# EAGLE design same70_bb (EAGLE 7.3.0)
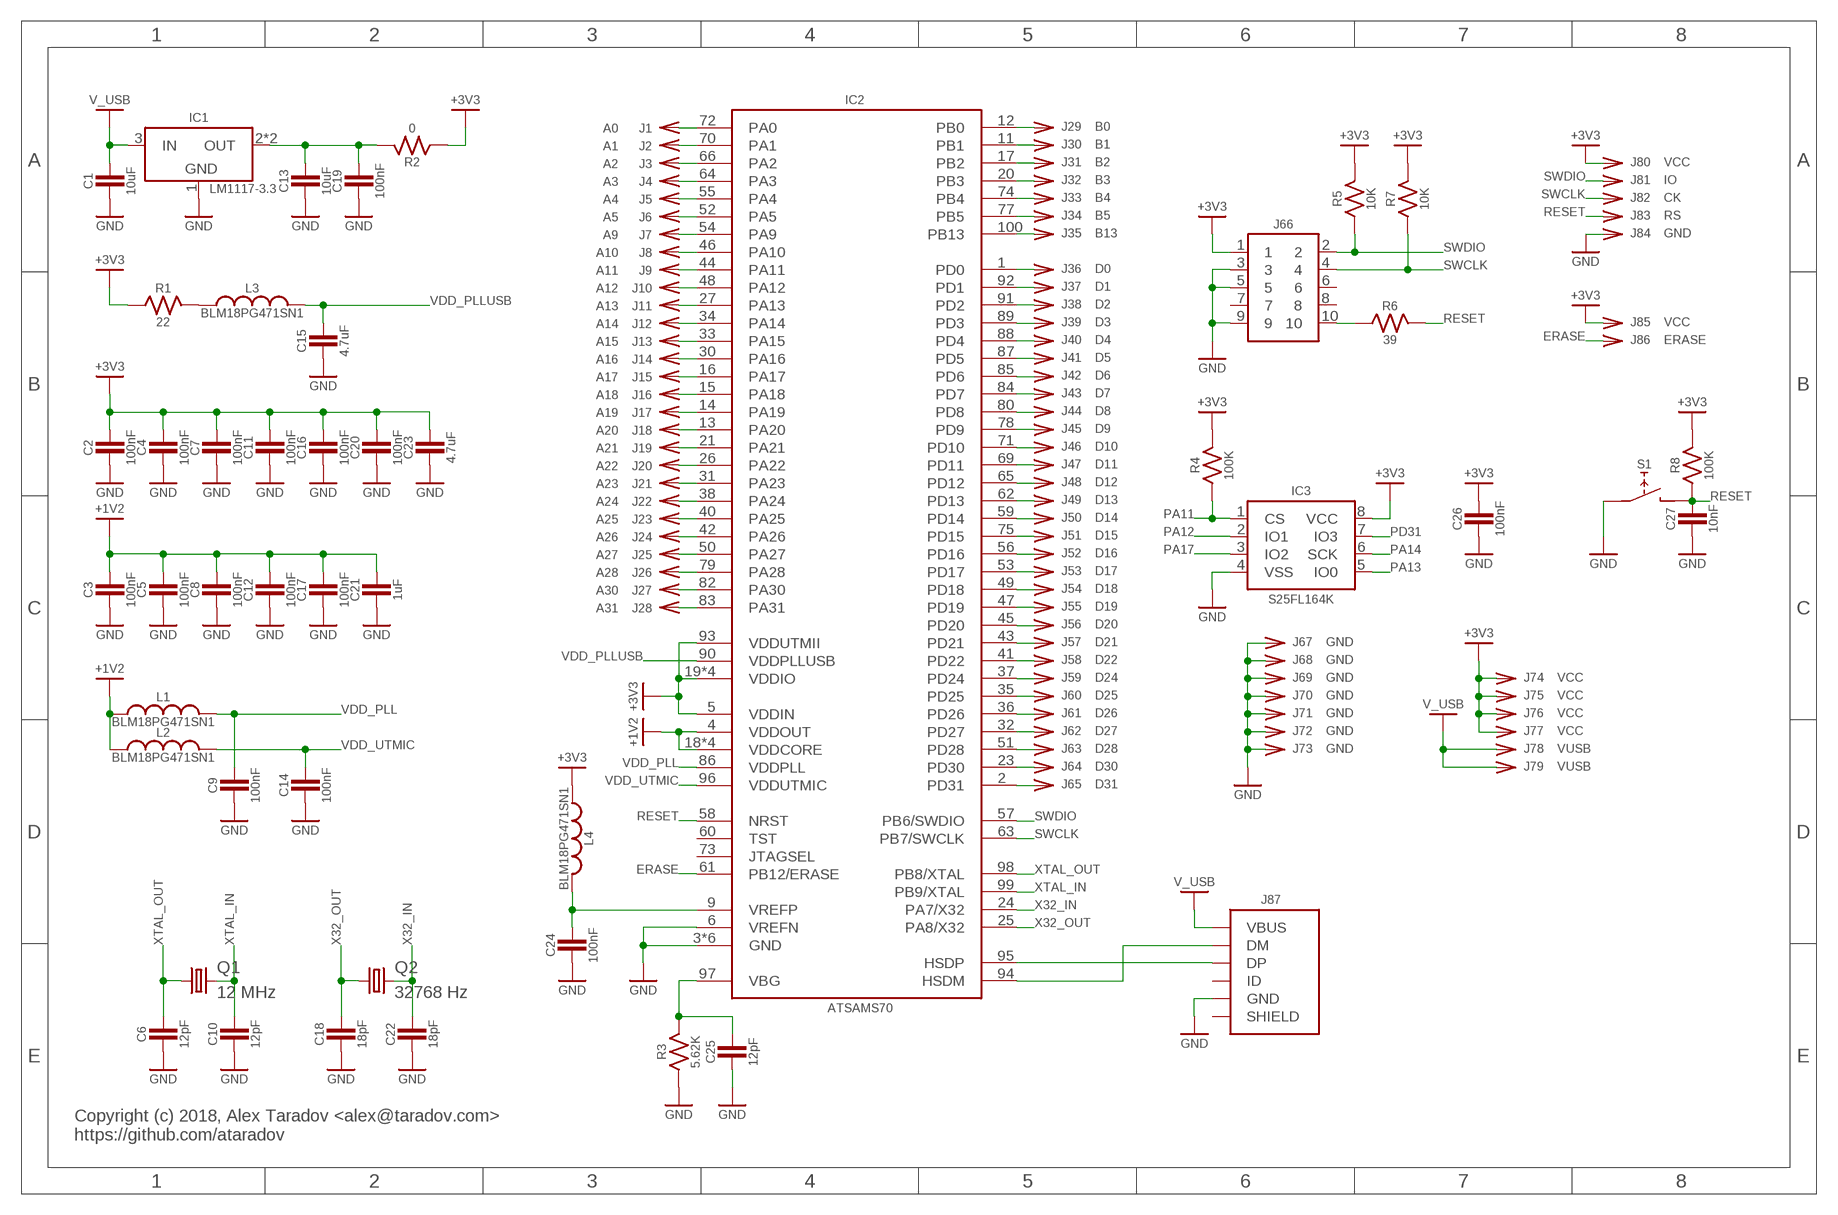
[diagram p0: schematic, sheet 1]

## Parts
C1  10uF  C-0805  [SMD0805]
C2  100nF  C-0603  [SMD0603]
C3  100nF  C-0603  [SMD0603]
C4  100nF  C-0603  [SMD0603]
C5  100nF  C-0603  [SMD0603]
C6  12pF  C-0603  [SMD0603]
C7  100nF  C-0603  [SMD0603]
C8  100nF  C-0603  [SMD0603]
C9  100nF  C-0603  [SMD0603]
C10  12pF  C-0603  [SMD0603]
C11  100nF  C-0603  [SMD0603]
C12  100nF  C-0603  [SMD0603]
C13  10uF  C-0805  [SMD0805]
C14  100nF  C-0603  [SMD0603]
C15  4.7uF  C-0603  [SMD0603]
C16  100nF  C-0603  [SMD0603]
C17  100nF  C-0603  [SMD0603]
C18  18pF  C-0603  [SMD0603]
C19  100nF  C-0603  [SMD0603]
C20  100nF  C-0603  [SMD0603]
C21  1uF  C-0603  [SMD0603]
C22  18pF  C-0603  [SMD0603]
C23  4.7uF  C-0603  [SMD0603]
C24  100nF  C-0603  [SMD0603]
C25  12pF  C-0603  [SMD0603]
C26  100nF  C-0603  [SMD0603]
C27  10nF  C-0603  [SMD0603]
IC1  LM1117-3.3  LM1117-SOT223  [SOT223]
IC2  ATSAMS70  [TQFP-100-0.5MM]
IC3  S25FL164K  S25FL1-K  [SO8]
J1  A0  CONN-SINGLE-TH  [PIN-TH]
J2  A1  CONN-SINGLE-TH  [PIN-TH]
J3  A2  CONN-SINGLE-TH  [PIN-TH]
J4  A3  CONN-SINGLE-TH  [PIN-TH]
J5  A4  CONN-SINGLE-TH  [PIN-TH]
J6  A5  CONN-SINGLE-TH  [PIN-TH]
J7  A9  CONN-SINGLE-TH  [PIN-TH]
J8  A10  CONN-SINGLE-TH  [PIN-TH]
J9  A11  CONN-SINGLE-TH  [PIN-TH]
J10  A12  CONN-SINGLE-TH  [PIN-TH]
J11  A13  CONN-SINGLE-TH  [PIN-TH]
J12  A14  CONN-SINGLE-TH  [PIN-TH]
J13  A15  CONN-SINGLE-TH  [PIN-TH]
J14  A16  CONN-SINGLE-TH  [PIN-TH]
J15  A17  CONN-SINGLE-TH  [PIN-TH]
J16  A18  CONN-SINGLE-TH  [PIN-TH]
J17  A19  CONN-SINGLE-TH  [PIN-TH]
J18  A20  CONN-SINGLE-TH  [PIN-TH]
J19  A21  CONN-SINGLE-TH  [PIN-TH]
J20  A22  CONN-SINGLE-TH  [PIN-TH]
J21  A23  CONN-SINGLE-TH  [PIN-TH]
J22  A24  CONN-SINGLE-TH  [PIN-TH]
J23  A25  CONN-SINGLE-TH  [PIN-TH]
J24  A26  CONN-SINGLE-TH  [PIN-TH]
J25  A27  CONN-SINGLE-TH  [PIN-TH]
J26  A28  CONN-SINGLE-TH  [PIN-TH]
J27  A30  CONN-SINGLE-TH  [PIN-TH]
J28  A31  CONN-SINGLE-TH  [PIN-TH]
J29  B0  CONN-SINGLE-TH  [PIN-TH]
J30  B1  CONN-SINGLE-TH  [PIN-TH]
J31  B2  CONN-SINGLE-TH  [PIN-TH]
J32  B3  CONN-SINGLE-TH  [PIN-TH]
J33  B4  CONN-SINGLE-TH  [PIN-TH]
J34  B5  CONN-SINGLE-TH  [PIN-TH]
J35  B13  CONN-SINGLE-TH  [PIN-TH]
J36  D0  CONN-SINGLE-TH  [PIN-TH]
J37  D1  CONN-SINGLE-TH  [PIN-TH]
J38  D2  CONN-SINGLE-TH  [PIN-TH]
J39  D3  CONN-SINGLE-TH  [PIN-TH]
J40  D4  CONN-SINGLE-TH  [PIN-TH]
J41  D5  CONN-SINGLE-TH  [PIN-TH]
J42  D6  CONN-SINGLE-TH  [PIN-TH]
J43  D7  CONN-SINGLE-TH  [PIN-TH]
J44  D8  CONN-SINGLE-TH  [PIN-TH]
J45  D9  CONN-SINGLE-TH  [PIN-TH]
J46  D10  CONN-SINGLE-TH  [PIN-TH]
J47  D11  CONN-SINGLE-TH  [PIN-TH]
J48  D12  CONN-SINGLE-TH  [PIN-TH]
J49  D13  CONN-SINGLE-TH  [PIN-TH]
J50  D14  CONN-SINGLE-TH  [PIN-TH]
J51  D15  CONN-SINGLE-TH  [PIN-TH]
J52  D16  CONN-SINGLE-TH  [PIN-TH]
J53  D17  CONN-SINGLE-TH  [PIN-TH]
J54  D18  CONN-SINGLE-TH  [PIN-TH]
J55  D19  CONN-SINGLE-TH  [PIN-TH]
J56  D20  CONN-SINGLE-TH  [PIN-TH]
J57  D21  CONN-SINGLE-TH  [PIN-TH]
J58  D22  CONN-SINGLE-TH  [PIN-TH]
J59  D24  CONN-SINGLE-TH  [PIN-TH]
J60  D25  CONN-SINGLE-TH  [PIN-TH]
J61  D26  CONN-SINGLE-TH  [PIN-TH]
J62  D27  CONN-SINGLE-TH  [PIN-TH]
J63  D28  CONN-SINGLE-TH  [PIN-TH]
J64  D30  CONN-SINGLE-TH  [PIN-TH]
J65  D31  CONN-SINGLE-TH  [PIN-TH]
J66  HEADER-5X2-TH-1.27  [HEADER-5X2-1.27MM]
J67  GND  CONN-SINGLE-TH  [PIN-TH]
J68  GND  CONN-SINGLE-TH  [PIN-TH]
J69  GND  CONN-SINGLE-TH  [PIN-TH]
J70  GND  CONN-SINGLE-TH  [PIN-TH]
J71  GND  CONN-SINGLE-TH  [PIN-TH]
J72  GND  CONN-SINGLE-TH  [PIN-TH]
J73  GND  CONN-SINGLE-TH  [PIN-TH]
J74  VCC  CONN-SINGLE-TH  [PIN-TH]
J75  VCC  CONN-SINGLE-TH  [PIN-TH]
J76  VCC  CONN-SINGLE-TH  [PIN-TH]
J77  VCC  CONN-SINGLE-TH  [PIN-TH]
J78  VUSB  CONN-SINGLE-TH  [PIN-TH]
J79  VUSB  CONN-SINGLE-TH  [PIN-TH]
J80  VCC  CONN-SINGLE-TH  [PIN-TH]
J81  IO  CONN-SINGLE-TH  [PIN-TH]
J82  CK  CONN-SINGLE-TH  [PIN-TH]
J83  RS  CONN-SINGLE-TH  [PIN-TH]
J84  GND  CONN-SINGLE-TH  [PIN-TH]
J85  VCC  CONN-SINGLE-TH  [PIN-TH]
J86  ERASE  CONN-SINGLE-TH  [PIN-TH]
J87  USB-B-MICRO-SMT  [USB-B-MICRO-SMT-SHELL-TH]
L1  BLM18PG471SN1  L-0603  [SMD0603]
L2  BLM18PG471SN1  L-0603  [SMD0603]
L3  BLM18PG471SN1  L-0603  [SMD0603]
L4  BLM18PG471SN1  L-0603  [SMD0603]
Q1  12 MHz  CRYSTALCTS406  [CTS406]
Q2  32768 Hz  CRYSTALTC38H  [TC38H]
R1  22  R-0603  [SMD0603]
R2  0  R-0603  [SMD0603]
R3  5.62K  R-0603  [SMD0603]
R4  100K  R-0603  [SMD0603]
R5  10K  R-0603  [SMD0603]
R6  39  R-0603  [SMD0603]
R7  10K  R-0603  [SMD0603]
R8  100K  R-0603  [SMD0603]
S1  TACT_SWITCH_6MM-SMD  [TACT-SMD-6MM]

## Nets
+1V2: C3.2 C5.2 C8.2 C12.2 C17.2 C21.2 IC2.4(VDDOUT) IC2.18(VDDCORE) IC2.22(VDDCORE) IC2.39(VDDCORE) IC2.76(VDDCORE) L1.1 L2.1
+3V3: C2.2 C4.2 C7.2 C11.2 C16.2 C20.2 C23.2 C26.2 IC2.5(VDDIN) IC2.19(VDDIO) IC2.28(VDDIO) IC2.68(VDDIO) IC2.81(VDDIO) IC2.93(VDDUTMII) IC3.8(VCC) J66.1 J74.1 J75.1 J76.1 J77.1 J80.1 J85.1 L4.1 R1.1 R2.1 R4.2 R5.2 R7.2 R8.2
ERASE: IC2.61(PB12/ERASE) J86.1
GND: C1.1 C2.1 C3.1 C4.1 C5.1 C6.1 C7.1 C8.1 C9.1 C10.1 C11.1 C12.1 C13.1 C14.1 C15.1 C16.1 C17.1 C18.1 C19.1 C20.1 C21.1 C22.1 C23.1 C24.1 C25.1 C26.1 C27.1 IC1.1(GND) IC2.3(GND) IC2.6(VREFN) IC2.7(GND) IC2.8(GND) IC2.10(GND) IC2.29(GND) IC2.67(GND) IC3.4(VSS) J66.3 J66.5 J66.9 J67.1 J68.1 J69.1 J70.1 J71.1 J72.1 J73.1 J84.1 J87.5(GND) R3.1 S1.1 S1.2
N$1: IC2.45(PD20) J56.1
N$2: J66.10 R6.1
N$3: IC2.12(PB0) J29.1
N$4: IC2.11(PB1) J30.1
N$5: IC2.17(PB2) J31.1
N$6: IC2.20(PB3) J32.1
N$7: IC2.74(PB4) J33.1
N$8: IC2.77(PB5) J34.1
N$9: IC2.89(PD3) J39.1
N$12: IC2.47(PD19) J55.1
N$13: IC2.49(PD18) J54.1
N$14: IC2.53(PD17) J53.1
N$15: IC2.100(PB13) J35.1
N$16: IC2.1(PD0) J36.1
N$17: IC2.92(PD1) J37.1
N$18: IC2.91(PD2) J38.1
N$19: IC2.56(PD16) J52.1
N$20: IC2.75(PD15) J51.1
N$21: IC2.59(PD14) J50.1
N$22: IC2.62(PD13) J49.1
N$23: IC2.65(PD12) J48.1
N$24: IC2.69(PD11) J47.1
N$25: IC2.71(PD10) J46.1
N$26: IC2.78(PD9) J45.1
N$27: IC2.80(PD8) J44.1
N$28: IC2.84(PD7) J43.1
N$30: IC2.23(PD30) J64.1
N$31: IC2.51(PD28) J63.1
N$32: IC2.32(PD27) J62.1
N$33: IC2.36(PD26) J61.1
N$34: IC2.35(PD25) J60.1
N$35: IC2.37(PD24) J59.1
N$36: IC2.41(PD22) J58.1
N$37: IC2.43(PD21) J57.1
N$38: IC2.85(PD6) J42.1
N$39: IC2.72(PA0) J1.1
N$40: IC2.70(PA1) J2.1
N$41: IC2.66(PA2) J3.1
N$42: IC2.64(PA3) J4.1
N$43: IC2.55(PA4) J5.1
N$44: IC2.52(PA5) J6.1
N$45: IC2.54(PA9) J7.1
N$46: IC2.46(PA10) J8.1
N$48: IC2.88(PD4) J40.1
N$49: IC2.87(PD5) J41.1
N$51: IC2.33(PA15) J13.1
N$52: IC2.30(PA16) J14.1
N$54: IC2.15(PA18) J16.1
N$55: IC2.14(PA19) J17.1
N$56: IC2.13(PA20) J18.1
N$57: IC2.21(PA21) J19.1
N$58: IC2.26(PA22) J20.1
N$59: IC2.31(PA23) J21.1
N$60: IC2.38(PA24) J22.1
N$61: IC2.42(PA26) J24.1
N$62: IC2.50(PA27) J25.1
N$63: IC2.79(PA28) J26.1
N$64: IC2.82(PA30) J27.1
N$65: IC2.83(PA31) J28.1
N$66: IC2.40(PA25) J23.1
N$68: C25.2 IC2.97(VBG) R3.2
N$70: IC2.94(HSDM) J87.2(DM)
N$71: C24.2 IC2.9(VREFP) L4.2
N$72: C13.2 C19.2 IC1.2(OUT) IC1.4(OUT) R2.2
N$73: IC2.95(HSDP) J87.3(DP)
N$74: L3.1 R1.2
PA11: IC2.44(PA11) IC3.1(CS) J9.1 R4.1
PA12: IC2.48(PA12) IC3.2(IO1) J10.1
PA13: IC2.27(PA13) IC3.5(IO0) J11.1
PA14: IC2.34(PA14) IC3.6(SCK) J12.1
PA17: IC2.16(PA17) IC3.3(IO2) J15.1
PD31: IC2.2(PD31) IC3.7(IO3) J65.1
RESET: C27.2 IC2.58(NRST) J83.1 R6.2 R8.1 S1.3 S1.4
SWCLK: IC2.63(PB7/SWCLK) J66.4 J82.1 R7.1
SWDIO: IC2.57(PB6/SWDIO) J66.2 J81.1 R5.1
V_USB: C1.2 IC1.3(IN) J78.1 J79.1 J87.1(VBUS)
VDD_PLL: C9.2 IC2.86(VDDPLL) L1.2
VDD_PLLUSB: C15.2 IC2.90(VDDPLLUSB) L3.2
VDD_UTMIC: C14.2 IC2.96(VDDUTMIC) L2.2
X32_IN: C22.2 IC2.24(PA7/X32) Q2.2
X32_OUT: C18.2 IC2.25(PA8/X32) Q2.1
XTAL_IN: C10.2 IC2.99(PB9/XTAL) Q1.3
XTAL_OUT: C6.2 IC2.98(PB8/XTAL) Q1.1
Unconnected: IC2.60(TST) IC2.73(JTAGSEL) J66.6 J66.7 J66.8 J87.4(ID) J87.M1(SHIELD) J87.M2(SHIELD) J87.M3(SHIELD) J87.M4(SHIELD)

## Notes on the sheet
- Copyright (c) 2018, Alex Taradov <alex@taradov.com>
  https://github.com/ataradov

## Library data of the parts
C1-C27 = ataradov:C
IC1 = ataradov:LM1117: LM1117 voltage regulator
IC2 = ataradov:ATSAMS70
IC3 = ataradov:S25FL1-K
J1-J65 J67-J86 = ataradov:CONN-SINGLE
J66 = ataradov:HEADER-5X2
J87 = ataradov_conn:USB-B-MICRO
L1-L4 = ataradov:L
Q1 Q2 = crystal:CRYSTAL: CRYSTAL; OC_FARNELL: unknown; OC_NEWARK: unknown
R1-R8 = ataradov:R
S1 = ataradov:TACT_SWITCH_6MM

## Board
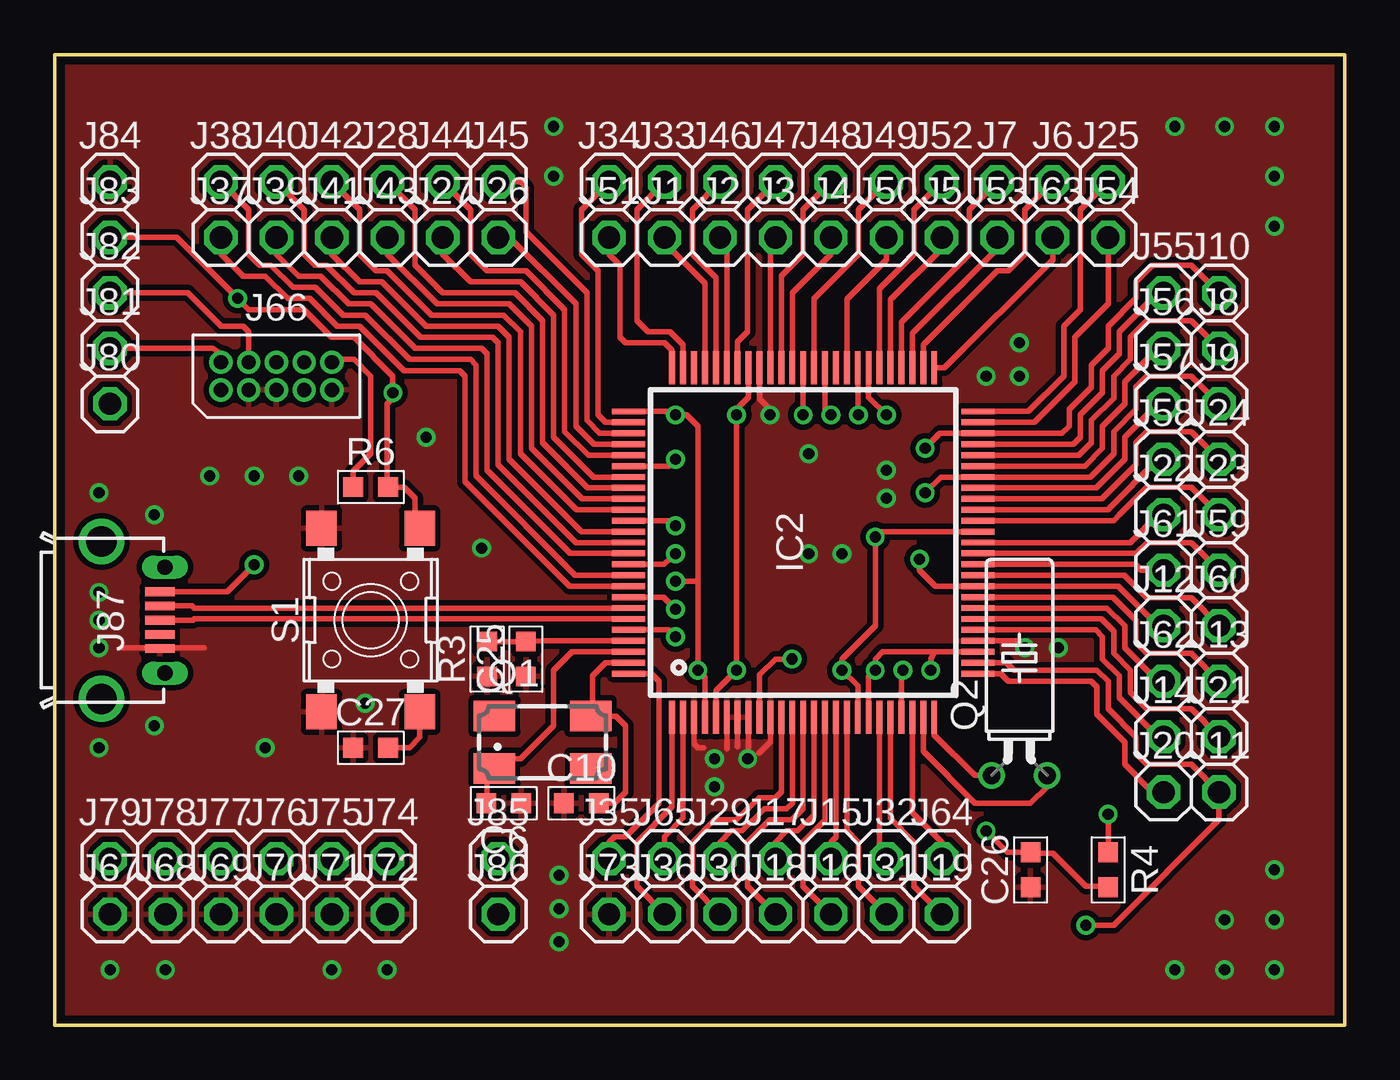
[diagram p1: board, top side]
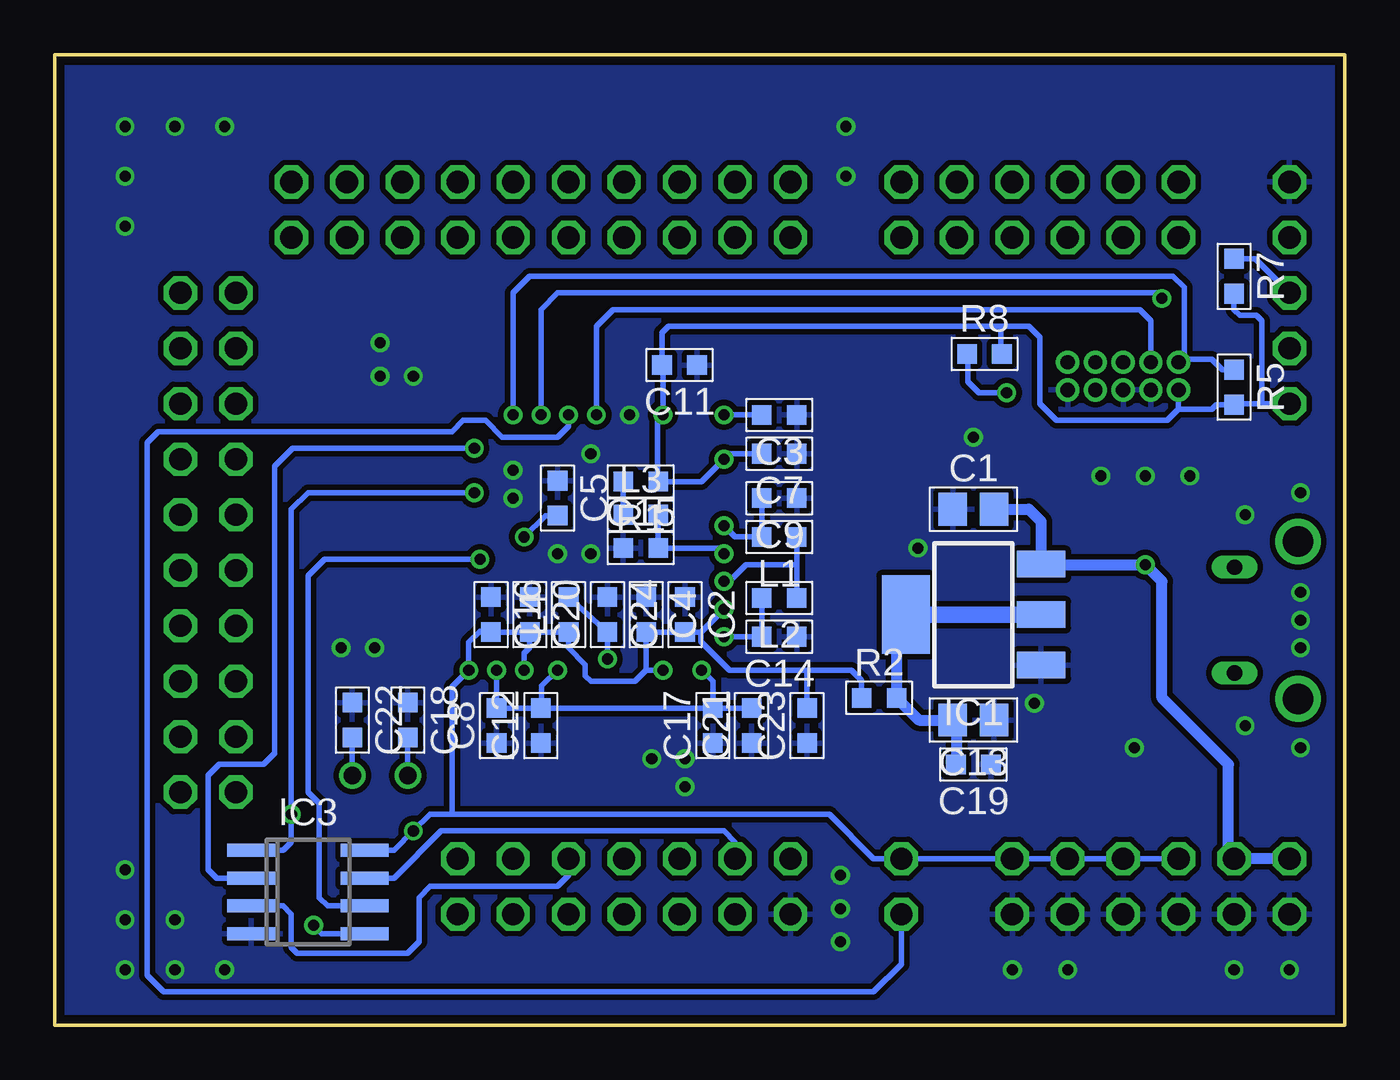
[diagram p2: board, bottom side, seen from below]

Size 59.11 x 44.44 mm. Coordinates in mm from the lower left corner, seen from the top.
Outline: 0,0 59.11,0 59.11,44.44 0,44.44 0,0
Copper layers (1*16): Top 0.0356mm / dielectric 1.5011mm / Bottom 0.0356mm
Design rules "std-tented": minimum track width 6mil, minimum drill 13mil, track to track 6mil, track to pad 6mil, pad to pad 6mil, via to via 6mil, smd to smd 6mil, copper to edge 15mil, drill to drill 6mil, minimum pad ring 7mil, minimum via ring 7mil, stop-mask expansion 3mil, vias tented up to drill 25mil, thermal gap 10mil

### Footprints (pad centres in the part's own frame; a part is rotated, then mirrored left to right if it is on the bottom)
SMD0805 = smd 1.3 x 1.5: 1 -0.95,0; 2 0.95,0
SMD0603 = smd 0.9 x 0.9: 1 -0.8,0; 2 0.8,0
SOT223 = smd 1.219 x 2.235: 1 -2.311,-3.099; 2 0,-3.099; 3 2.311,-3.099 | smd 3.6 x 2.2: 4 0,3.099
TQFP-100-0.5MM = smd 1.5 x 0.27: 1 -8,6; 2 -8,5.5; 3 -8,5; 4 -8,4.5; 5 -8,4; 6 -8,3.5; 7 -8,3; 8 -8,2.5; 9 -8,2; 10 -8,1.5; 11 -8,1; 12 -8,0.5; 13 -8,0; 14 -8,-0.5; 15 -8,-1; 16 -8,-1.5; 17 -8,-2; 18 -8,-2.5; 19 -8,-3; 20 -8,-3.5; 21 -8,-4; 22 -8,-4.5; 23 -8,-5; 24 -8,-5.5; 25 -8,-6; 51 8,-6; 52 8,-5.5; 53 8,-5; 54 8,-4.5; 55 8,-4; 56 8,-3.5; 57 8,-3; 58 8,-2.5; 59 8,-2; 60 8,-1.5; 61 8,-1; 62 8,-0.5; 63 8,0; 64 8,0.5; 65 8,1; 66 8,1.5; 67 8,2; 68 8,2.5; 69 8,3; 70 8,3.5; 71 8,4; 72 8,4.5; 73 8,5; 74 8,5.5; 75 8,6 | smd 0.27 x 1.5: 26 -6,-8; 27 -5.5,-8; 28 -5,-8; 29 -4.5,-8; 30 -4,-8; 31 -3.5,-8; 32 -3,-8; 33 -2.5,-8; 34 -2,-8; 35 -1.5,-8; 36 -1,-8; 37 -0.5,-8; 38 0,-8; 39 0.5,-8; 40 1,-8; 41 1.5,-8; 42 2,-8; 43 2.5,-8; 44 3,-8; 45 3.5,-8; 46 4,-8; 47 4.5,-8; 48 5,-8; 49 5.5,-8; 50 6,-8; 76 6,8; 77 5.5,8; 78 5,8; 79 4.5,8; 80 4,8; 81 3.5,8; 82 3,8; 83 2.5,8; 84 2,8; 85 1.5,8; 86 1,8; 87 0.5,8; 88 0,8; 89 -0.5,8; 90 -1,8; 91 -1.5,8; 92 -2,8; 93 -2.5,8; 94 -3,8; 95 -3.5,8; 96 -4,8; 97 -4.5,8; 98 -5,8; 99 -5.5,8; 100 -6,8
SO8 = smd 0.6 x 2.2: 1 -1.905,-2.6; 2 -0.635,-2.6; 3 0.635,-2.6; 4 1.905,-2.6; 5 1.905,2.6; 6 0.635,2.6; 7 -0.635,2.6; 8 -1.905,2.6
PIN-TH = drill 1.016 octagon: 1 0,0
HEADER-5X2-1.27MM = drill 0.66 pad 1.067: 1 -2.54,-0.635; 2 -2.54,0.635; 3 -1.27,-0.635; 4 -1.27,0.635; 5 0,-0.635; 6 0,0.635; 7 1.27,-0.635; 8 1.27,0.635; 9 2.54,-0.635; 10 2.54,0.635
USB-B-MICRO-SMT-SHELL-TH = smd 1.35 x 0.4: 1 4.825,1.3; 2 4.825,0.65; 3 4.825,0; 4 4.825,-0.65; 5 4.825,-1.3 | drill 1.397: M1 2.15,-3.6; M2 2.15,3.6 | drill 0.7 long: M3 5.05,2.425; M4 5.05,-2.425
CTS406 = smd 1.9 x 1.4: 1 -2.2,-1.2; 2 2.2,-1.2; 3 2.2,1.2; 4 -2.2,1.2
TC38H = drill 0.813: 1 -1.27,0; 2 1.27,0
TACT-SMD-6MM = smd 1.6 x 1.4: 1 -4.2,2.25; 2 4.2,2.25; 3 -4.2,-2.25; 4 4.2,-2.25

### Placement (x,y rotation side)
C1  17.02,23.62 0 bottom
C2  30.23,18.8 270 bottom
C3  25.91,27.94 180 bottom
C4  32,18.8 270 bottom
C5  36.07,24.13 270 bottom
C6  20.57,10.16 180 top
C7  25.91,26.16 180 bottom
C8  38.86,13.72 90 bottom
C9  25.91,24.13 180 bottom
C10  24.13,10.16 0 top
C11  30.48,30.23 180 bottom
C12  36.83,13.72 90 bottom
C13  17.02,13.97 180 bottom
C14  25.91,17.78 180 bottom
C15  32.26,21.84 0 bottom
C16  39.12,18.8 270 bottom
C17  28.96,13.72 90 bottom
C18  42.93,13.97 270 bottom
C19  17.02,11.94 180 bottom
C20  37.34,18.8 270 bottom
C21  27.18,13.72 90 bottom
C22  45.47,13.97 270 bottom
C23  24.64,13.72 90 bottom
C24  33.78,18.8 270 bottom
C25  21.59,16.76 90 top
C26  44.7,7.11 90 top
C27  14.48,12.7 0 top
IC1  17.02,18.8 90 bottom
IC2  34.29,22.1 90 top
IC3  47.5,6.1 270 bottom
J1  27.94,36.07 0 top
J2  30.48,36.07 0 top
J3  33.02,36.07 0 top
J4  35.56,36.07 0 top
J5  40.64,36.07 0 top
J6  45.72,38.61 0 top
J7  43.18,38.61 0 top
J8  53.34,30.99 0 top
J9  53.34,28.45 0 top
J10  53.34,33.53 0 top
J11  53.34,10.67 0 top
J12  50.8,18.29 0 top
J13  53.34,15.75 0 top
J14  50.8,13.21 0 top
J15  35.56,7.62 0 top
J16  35.56,5.08 0 top
J17  33.02,7.62 0 top
J18  33.02,5.08 0 top
J19  40.64,5.08 0 top
J20  50.8,10.67 0 top
J21  53.34,13.21 0 top
J22  50.8,23.37 0 top
J23  53.34,23.37 0 top
J24  53.34,25.91 0 top
J25  48.26,38.61 0 top
J26  20.32,36.07 0 top
J27  17.78,36.07 0 top
J28  15.24,38.61 0 top
J29  30.48,7.62 0 top
J30  30.48,5.08 0 top
J31  38.1,5.08 0 top
J32  38.1,7.62 0 top
J33  27.94,38.61 0 top
J34  25.4,38.61 0 top
J35  25.4,7.62 0 top
J36  27.94,5.08 0 top
J37  7.62,36.07 0 top
J38  7.62,38.61 0 top
J39  10.16,36.07 0 top
J40  10.16,38.61 0 top
J41  12.7,36.07 0 top
J42  12.7,38.61 0 top
J43  15.24,36.07 0 top
J44  17.78,38.61 0 top
J45  20.32,38.61 0 top
J46  30.48,38.61 0 top
J47  33.02,38.61 0 top
J48  35.56,38.61 0 top
J49  38.1,38.61 0 top
J50  38.1,36.07 0 top
J51  25.4,36.07 0 top
J52  40.64,38.61 0 top
J53  43.18,36.07 0 top
J54  48.26,36.07 0 top
J55  50.8,33.53 0 top
J56  50.8,30.99 0 top
J57  50.8,28.45 0 top
J58  50.8,25.91 0 top
J59  53.34,20.83 0 top
J60  53.34,18.29 0 top
J61  50.8,20.83 0 top
J62  50.8,15.75 0 top
J63  45.72,36.07 0 top
J64  40.64,7.62 0 top
J65  27.94,7.62 0 top
J66  10.16,29.72 0 top
J67  2.54,5.08 0 top
J68  5.08,5.08 0 top
J69  7.62,5.08 0 top
J70  10.16,5.08 0 top
J71  12.7,5.08 0 top
J72  15.24,5.08 0 top
J73  25.4,5.08 0 top
J74  15.24,7.62 0 top
J75  12.7,7.62 0 top
J76  10.16,7.62 0 top
J77  7.62,7.62 0 top
J78  5.08,7.62 0 top
J79  2.54,7.62 0 top
J80  2.54,28.45 0 top
J81  2.54,30.99 0 top
J82  2.54,33.53 0 top
J83  2.54,36.07 0 top
J84  2.54,38.61 0 top
J85  20.32,7.62 0 top
J86  20.32,5.08 0 top
J87  0,18.54 0 top
L1  25.91,22.35 180 bottom
L2  25.91,19.56 180 bottom
L3  32.26,23.37 0 bottom
L4  35.56,18.8 90 bottom
Q1  22.35,12.95 0 top
Q2  44.2,11.43 0 top
R1  32.26,24.89 180 bottom
R2  21.34,14.99 0 bottom
R3  19.81,16.76 90 top
R4  48.26,7.11 270 top
R5  5.08,29.21 270 bottom
R6  14.48,24.64 0 top
R7  5.08,34.29 270 bottom
R8  16.51,30.73 0 bottom
S1  14.48,18.54 90 top

### Tracks (layer width: path | path; a pad name or v marks a point on that pad's centre or on a via)
+1V2  (via drill 0.51)
  Top 0.254: v38.86,16.26 38.79,16.18 IC2.22 | IC2.18 36.79,15.53 v36.07,16.26 36.07,16.76 37.59,18.29 v37.59,22.35 37.84,22.6 IC2.39 | IC2.4 29.79,15.93 v29.46,16.26 29.46,20.32 | IC2.76 28.04,28.1 28.19,27.94 v28.45,27.94 28.96,27.94 29.46,27.43 29.46,20.32 | v28.45,20.32 29.46,20.32
  Bottom 0.254: v38.86,16.26 C8.2 C12.2 | C21.2 C17.2 | C17.2 28.96,15.75 v29.46,16.26 | C12.2 36.79,14.56 36.79,15.53 v36.07,16.26 | C3.2 v28.45,27.94 | L1.1 25.11,21.08 | 25.11,21.08 L2.1 | v28.45,20.32 28.19,20.32 27.43,21.08 25.11,21.08 | C12.2 C17.2 | v37.59,22.35 36.61,23.33 C5.2
+3V3  (via drill 0.51)
  Top 0.254: IC2.19 37.29,15.95 v37.59,16.26 37.59,16.76 37.93,17.1 40.31,17.1 | IC2.5 30.29,15.3 v31.24,16.26 v31.24,27.94 31.24,28.19 31.79,28.74 IC2.68 | IC2.93 27.9,19.6 v28.45,19.05 | v28.45,25.91 28.14,25.6 IC2.81 | v40.13,16.26 40.13,16.76 40.31,17.1 | 40.31,17.1 IC2.28 | R4.2 48.22,6.35 47.24,6.35 45.72,7.87 44.74,7.87 C26.2 43.65,7.91 v42.67,8.89
  Bottom 0.254: C16.2 C20.2 | C7.2 28.19,26.16 v28.45,25.91 29.46,24.89 R1.1 31.5,24.89 31.5,27.69 v31.24,27.94 31.24,29.72 C11.2 31.28,31.71 30.99,32 15.75,32 | v28.45,19.05 29.5,18 | 29.5,18 C2.2 C4.2 32,16.26 | C20.2 L4.1 35.56,17.27 34.8,16.51 34.8,16 34.54,15.75 32.51,15.75 32,16.26 | 32,16.26 v31.24,16.26 | C20.2 37.34,17.27 37.59,17.02 v37.59,16.26 | 24.64,16.26 28.19,16.26 29.5,17.56 29.5,18 | C23.2 24.64,16.26 | 24.64,16.26 22.61,16.26 22.14,15.79 R2.1 | 39.12,18.03 39.62,18.03 40.13,17.53 v40.13,16.26 40.89,15.49 40.89,9.65 | IC3.8 43.56,8 v42.67,8.89 41.91,9.65 40.89,9.65 | 40.89,9.65 23.62,9.65 21.59,7.62 J85.1 J74.1 J75.1 J76.1 J77.1 | R7.2 5.08,32.77 4.83,32.51 4.06,32.51 3.81,32.26 3.81,28.45 | J80.1 3.81,28.45 | 3.81,28.45 5.08,28.45 R5.2 5.88,28.41 6.1,28.19 7.62,28.19 | 15.75,32 14.48,32 13.97,31.5 13.97,28.45 13.21,27.69 8.13,27.69 7.62,28.19 | 7.62,28.19 J66.1 | R8.2 15.75,30.77 15.75,32
ERASE  (via drill 0.51)
  Top 0.254: v35.56,27.94 35.29,28.21 IC2.61
  Bottom 0.254: v35.56,27.94 35.56,27.43 36.07,26.92 38.61,26.92 39.37,27.69 40.39,27.69 40.89,27.18 54.36,27.18 54.86,26.67 54.86,2.29 54.1,1.52 21.59,1.52 20.32,2.79 J86.1
GND  (via drill 0.51)
  Top 0.254: IC2.3 29.29,12.87 29.46,12.7 29.72,12.7 | v44.45,17.27 44.12,17.6 IC2.29 | v32.77,27.94 32.77,28.19 32.29,28.67 IC2.67 | 31.79,12.41 IC2.8 | 30.79,12.64 IC2.6 | IC2.10 32.79,12.98 32.26,12.45 | 31.29,12.75 IC2.7 | J87.5 4.79,17.27 | 4.79,17.27 6.86,17.27 | 4.79,17.27 3.05,17.27
  other vias: 30.23,12.19 31.75,12.19 30.23,10.92 34.54,26.16 38.1,25.4 38.1,24.13 36.07,21.59 34.54,21.59 45.97,17.27 51.31,2.54 53.59,4.83 55.88,4.83 55.88,7.11 55.88,2.54 53.59,2.54 53.59,41.15 55.88,41.15 55.88,38.86 55.88,36.58 51.31,41.15 42.67,29.72 44.2,31.24 44.2,29.72 23.11,6.86 23.11,5.33 23.11,3.81 2.03,24.38 4.57,23.37 7.11,25.15 9.65,12.7 4.57,13.72 2.03,12.7 9.14,25.15 11.18,25.15 17.02,26.92 19.56,21.84 14.22,14.73 15.24,2.54 12.7,2.54 5.08,2.54 2.54,2.54 22.86,41.15 22.86,38.86 2.03,19.81 2.03,18.54 2.03,17.27
  pour Bottom (isolate 0.254): 0,44.45 59.18,44.45 59.18,0 0,0
  pour Top (isolate 0.254): 59.18,44.45 59.18,0 0,0 0,44.45
N$1
  Top 0.254: J56.1 50.55,30.99 49.02,29.46 49.02,28.45 48.01,27.43 48.01,26.42 47.19,25.6 IC2.45
N$2
  Top 0.254: J66.10 12.83,30.48 13.72,30.48 14.48,29.72 14.48,26.16 13.68,25.36 R6.1
N$3
  Top 0.254: J29.1 30.48,8.38 30.99,8.89 31.5,8.89 32.51,9.91 33.53,9.91 33.79,10.17 IC2.12
N$4
  Top 0.254: J30.1 29.21,6.35 29.21,8.38 30.23,9.4 31.24,9.4 32.26,10.41 33.02,10.41 33.29,10.68 IC2.11
N$5
  Top 0.254: J31.1 36.83,6.35 36.83,8.38 36.29,8.92 IC2.17
N$6
  Top 0.254: J32.1 37.79,7.93 IC2.20
N$7
  Top 0.254: J33.1 26.67,37.34 26.67,32.26 27.18,31.75 28.19,31.75 28.79,31.15 IC2.74
N$8
  Top 0.254: J34.1 24.13,37.34 24.13,35.31 24.89,34.54 24.89,27.94 25.23,27.6 IC2.77
N$9
  Top 0.254: J39.1 10.16,35.31 11.18,34.29 12.19,34.29 13.46,33.02 14.48,33.02 16.51,30.99 19.56,30.99 19.81,30.73 19.81,25.4 23.61,21.6 IC2.89
N$12
  Top 0.254: J55.1 50.55,33.53 48.77,31.75 48.77,30.73 48.01,29.97 48.01,28.96 46.99,27.94 46.99,26.92 46.66,26.6 IC2.47
N$13
  Top 0.254: J54.1 48.26,33.02 46.74,31.5 46.74,29.46 44.87,27.6 IC2.49
N$14
  Top 0.254: J53.1 43.18,35.56 39.29,31.67 IC2.53
N$15
  Top 0.254: J35.1 25.4,8.38 25.65,8.64 26.16,8.64 27.69,10.16 27.69,15.75 27.34,16.1 IC2.100
N$16
  Top 0.254: J36.1 26.67,6.35 26.67,8.38 28.29,10 IC2.1
N$17
  Top 0.254: J37.1 7.62,35.31 8.64,34.29 9.65,34.29 10.67,33.27 11.68,33.27 12.95,32 13.97,32 16,29.97 18.54,29.97 18.8,29.72 18.8,24.89 23.59,20.1 IC2.92
N$18
  Top 0.254: J38.1 8.89,37.34 8.89,35.31 9.4,34.8 9.91,34.8 10.92,33.78 11.94,33.78 13.21,32.51 14.22,32.51 16.26,30.48 19.05,30.48 19.3,30.23 19.3,25.15 23.85,20.6 IC2.91
N$19
  Top 0.254: J52.1 39.37,37.34 39.37,35.31 37.79,33.73 IC2.56
N$20
  Top 0.254: J51.1 25.4,35.31 25.91,34.8 25.91,31.5 26.16,31.24 27.94,31.24 28.29,30.89 IC2.75
N$21
  Top 0.254: J50.1 38.1,35.05 36.29,33.24 IC2.59
N$22
  Top 0.254: J49.1 36.83,37.34 36.83,35.31 34.79,33.27 IC2.62
N$23
  Top 0.254: J48.1 34.29,37.34 34.29,35.31 33.29,34.31 IC2.65
N$24
  Top 0.254: J47.1 31.75,37.34 31.75,31.75 31.29,31.29 IC2.69
N$25
  Top 0.254: J46.1 29.21,37.34 29.21,35.31 30.29,34.23 IC2.71
N$26
  Top 0.254: J45.1 21.34,38.61 21.59,38.35 21.59,36.32 24.38,33.53 24.38,27.69 24.97,27.1 IC2.78
N$27
  Top 0.254: J44.1 19.05,37.34 19.05,35.31 19.81,34.54 21.59,34.54 23.37,32.77 23.37,27.18 24.45,26.1 IC2.80
N$28
  Top 0.254: J43.1 15.24,35.31 17.53,33.02 20.83,33.02 21.84,32 21.84,26.42 24.16,24.1 IC2.84
N$30
  Top 0.254: J64.1 40.64,8.38 39.29,9.73 IC2.23
N$31
  Top 0.254: J63.1 45.72,35.05 40.77,30.1 IC2.51
N$32
  Top 0.254: J62.1 50.55,15.75 49.02,17.27 49.02,18.29 48.21,19.1 IC2.32
N$33
  Top 0.254: J61.1 49.78,20.83 49.51,21.1 IC2.36
N$34
  Top 0.254: J60.1 52.07,19.56 50.04,19.56 49,20.6 IC2.35
N$35
  Top 0.254: J59.1 52.07,22.1 50.04,22.1 49.54,21.6 IC2.37
N$36
  Top 0.254: J58.1 50.55,25.91 48.24,23.6 IC2.41
N$37
  Top 0.254: J57.1 50.55,28.45 49.02,26.92 49.02,25.91 47.71,24.6 IC2.43
N$38
  Top 0.254: J42.1 13.97,37.34 13.97,35.31 14.73,34.54 15.24,34.54 17.27,32.51 20.57,32.51 21.34,31.75 21.34,26.16 23.9,23.6 IC2.85
N$39
  Top 0.254: J1.1 27.94,35.81 29.79,33.96 IC2.72
N$40
  Top 0.254: J2.1 30.79,35.76 IC2.70
N$41
  Top 0.254: J3.1 32.79,35.84 IC2.66
N$42
  Top 0.254: J4.1 35.56,35.31 33.79,33.54 IC2.64
N$43
  Top 0.254: J5.1 40.64,35.56 38.29,33.21 IC2.55
N$44
  Top 0.254: J6.1 44.45,37.34 44.45,35.31 43.69,34.54 43.18,34.54 39.79,31.15 IC2.52
N$45
  Top 0.254: J7.1 41.91,37.34 41.91,35.31 38.79,32.19 IC2.54
N$46
  Top 0.254: J8.1 52.07,32.26 50.04,32.26 49.28,31.5 49.28,30.48 48.51,29.72 48.51,28.7 47.5,27.69 47.5,26.67 46.93,26.1 IC2.46
N$48
  Top 0.254: J40.1 11.43,37.34 11.43,35.31 11.94,34.8 12.45,34.8 13.72,33.53 14.73,33.53 16.76,31.5 20.07,31.5 20.32,31.24 20.32,25.65 23.88,22.1 IC2.88
N$49
  Top 0.254: J41.1 12.7,35.31 13.97,34.04 14.99,34.04 17.02,32 20.32,32 20.83,31.5 20.83,25.91 24.14,22.6 IC2.87
N$51
  Top 0.254: J13.1 52.07,17.02 50.04,17.02 49.53,17.53 49.53,18.54 48.47,19.6 IC2.33
N$52
  Top 0.254: J14.1 50.55,13.21 48.77,14.99 48.77,16 48.01,16.76 48.01,17.78 47.69,18.1 IC2.30
N$54
  Top 0.254: J16.1 34.29,6.35 34.29,8.38 35.29,9.38 IC2.15
N$55
  Top 0.254: J17.1 33.02,8.38 33.53,8.89 34.04,8.89 34.79,9.64 IC2.14
N$56
  Top 0.254: J18.1 31.75,6.35 31.75,8.38 32.77,9.4 33.78,9.4 34.29,9.91 IC2.13
N$57
  Top 0.254: J19.1 39.37,6.35 39.37,8.38 38.29,9.46 IC2.21
N$58
  Top 0.254: J20.1 50.29,10.67 49.02,11.94 49.02,12.95 47.75,14.22 47.75,15.49 47.5,15.75 43.69,15.75 43.34,16.1 IC2.26
N$59
  Top 0.254: J21.1 52.07,14.48 50.04,14.48 49.28,15.24 49.28,16.26 48.51,17.02 48.51,18.03 47.95,18.6 IC2.31
N$60
  Top 0.254: IC2.38 49.28,22.1 50.55,23.37 J22.1
N$61
  Top 0.254: J24.1 52.07,27.18 50.04,27.18 49.53,26.67 49.53,25.65 47.97,24.1 IC2.42
N$62
  Top 0.254: J25.1 46.99,37.34 46.99,32.77 46.23,32 46.23,29.72 44.61,28.1 IC2.50
N$63
  Top 0.254: J26.1 20.83,36.07 23.88,33.02 23.88,27.43 24.71,26.6 IC2.79
N$64
  Top 0.254: J27.1 17.78,35.31 19.05,34.04 21.34,34.04 22.86,32.51 22.86,26.92 24.69,25.1 IC2.82
N$65
  Top 0.254: J28.1 16.51,37.34 16.51,34.8 17.78,33.53 21.08,33.53 22.35,32.26 22.35,26.67 24.42,24.6 IC2.83
N$66
  Top 0.254: IC2.40 48.51,23.1 48.77,23.37 50.04,24.64 52.07,24.64 J23.1
N$68
  Top 0.254: R3.2 C25.2 22.39,17.6 IC2.97
N$70
  Top 0.254: IC2.94 6.4,19.1 6.3,19.19 J87.2
N$71  (via drill 0.51)
  Top 0.254: v33.78,16.76 33.02,16.76 32.29,16.03 IC2.9
  Bottom 0.254: L4.2 C24.2 v33.78,16.76
N$72
  Bottom 0.254: C19.2 17.78,11.98 | 17.78,13.46 17.97,13.65 C13.2 | IC1.4 20.54,18.38
  Bottom 0.508: 17.78,11.98 17.78,13.46 | 20.54,18.38 R2.2 19.52,13.97 C13.2
  Bottom 0.762: IC1.2 IC1.4
N$73
  Top 0.254: IC2.95 6.41,18.6 6.35,18.54 J87.3
N$74
  Bottom 0.254: L3.1 R1.2
PA11  (via drill 0.51)
  Top 0.254: J9.1 52.07,29.72 50.04,29.72 49.53,29.21 49.53,28.19 48.51,27.18 48.51,26.16 47.45,25.1 IC2.44 40.59,25.1 v39.88,24.38 | R4.1 v48.26,9.65
  Bottom 0.254: v39.88,24.38 47.5,24.38 48.26,23.62 v48.26,9.65 48.26,8.38 48.64,8 IC3.1
PA12  (via drill 0.51)
  Top 0.254: J10.1 52.07,34.8 50.29,34.8 49.53,34.04 49.53,33.27 48.26,32 48.26,30.99 47.5,30.23 47.5,29.21 46.48,28.19 46.48,27.43 46.15,27.1 IC2.48 40.56,27.1 v39.88,26.42
  Bottom 0.254: v39.88,26.42 48.19,26.42 49.02,25.59 49.02,12.45 49.53,11.94 51.56,11.94 52.07,11.43 52.07,7.11 51.69,6.73 IC3.2
PA13  (via drill 0.51)
  Top 0.254: IC2.27 43.6,16.6 43.94,16.26 47.75,16.26 48.26,15.75 48.26,14.48 49.53,13.21 49.53,12.45 50.04,11.94 52.07,11.94 J11.1 53.34,9.4 48.51,4.57 v47.24,4.57
  Bottom 0.254: v47.24,4.57 46.86,4.19 IC3.5
PA14  (via drill 0.51)
  Top 0.254: J12.1 50.55,18.29 48.74,20.1 IC2.34 40.35,20.1 39.62,20.83 v39.62,21.34
  Bottom 0.254: v39.62,21.34 46.74,21.34 47.5,20.57 47.5,10.67 46.99,10.16 46.99,5.84 46.61,5.46 IC3.6
PA17
  Top 0.254: J15.1 35.56,8.38 35.79,8.61 IC2.16
  Bottom 0.254: J15.1 35.56,6.86 36.07,6.35 41.91,6.35 42.42,5.84 42.42,3.81 42.93,3.3 48.01,3.3 48.26,3.56 48.26,5.08 48.64,5.46 IC3.3
PD31
  Top 0.254: J65.1 27.94,8.64 28.79,9.49 IC2.2
  Bottom 0.254: J65.1 27.94,8.38 28.45,8.89 41.4,8.89 43.56,6.73 IC3.7
RESET  (via drill 0.51)
  Top 0.254: v36.83,27.94 36.79,28.15 IC2.58 | C27.2 16.26,12.7 16.73,13.17 S1.3 | J83.1 5.59,36.07 v8.38,33.27 8.89,32.77 11.43,32.77 12.7,31.5 13.72,31.5 15.49,29.72 v15.49,28.96 15.49,28.7 15.24,28.45 15.24,24.68 R6.2 16,24.64 16.51,24.13 16.51,22.96 S1.4
  Bottom 0.254: v36.83,27.94 36.83,32.77 36.07,33.53 8.64,33.53 v8.38,33.27 | R8.1 17.27,30.7 17.27,29.46 16.76,28.96 v15.49,28.96
SWCLK  (via drill 0.51)
  Top 0.254: v34.29,27.94 IC2.63 | J82.1 6.1,33.53 7.62,32 8.64,32 8.89,31.75 J66.4
  Bottom 0.254: v34.29,27.94 34.29,32 33.53,32.77 9.4,32.77 8.89,32.26 J66.4 | R7.1 4.1,35.09 J82.1
SWDIO  (via drill 0.51)
  Top 0.254: v38.1,27.94 37.29,28.75 IC2.57 | J81.1 7.24,30.99 7.62,30.73 J66.2
  Bottom 0.254: v38.1,27.94 38.1,33.53 37.34,34.29 7.87,34.29 7.37,33.78 7.37,30.61 J66.2 7.49,30.48 6.1,30.48 5.63,30.01 R5.1
V_USB  (via drill 0.51)
  Top 0.254: J87.1 7.9,19.84 v9.14,21.08
  Bottom 0.254: IC1.3 13.89,21.08
  Bottom 0.508: C1.2 14.48,23.62 13.92,23.06 IC1.3 | 13.89,21.08 v9.14,21.08 8.38,20.32 8.38,14.99 5.33,11.94 5.33,7.87 J78.1 J79.1
VDD_PLL  (via drill 0.51)
  Top 0.254: v28.45,22.86 28.21,23.1 IC2.86
  Bottom 0.254: C9.2 L1.2 27.94,22.35 v28.45,22.86
VDD_PLLUSB  (via drill 0.51)
  Top 0.254: v28.45,21.59 27.92,21.1 IC2.90
  Bottom 0.254: L3.2 C15.2 28.66,21.84 v28.45,21.59
VDD_UTMIC  (via drill 0.51)
  Top 0.254: v28.45,17.78 28.13,18.1 IC2.96
  Bottom 0.254: L2.2 C14.2 v28.45,17.78
X32_IN
  Top 0.254: IC2.24 39.79,12.53 42.16,10.16 44.7,10.16 45.47,10.92 Q2.2
  Bottom 0.254: Q2.2 C22.2
X32_OUT
  Top 0.254: IC2.25 40.29,13.3 42.16,11.43 Q2.1
  Bottom 0.254: Q2.1 C18.2
XTAL_IN
  Top 0.254: IC2.99 25.23,16.6 24.64,16 24.64,14.24 Q1.3 25.72,14.15 26.16,13.72 26.16,10.67 25.65,10.16 C10.2
XTAL_OUT
  Top 0.254: IC2.98 23.7,17.1 22.86,16.26 22.86,13.72 21.34,12.19 20.59,12.19 Q1.1 20.15,11.52 19.81,11.18 19.81,10.2 C6.2

### Text on the board
bValues: 09/24/2018 | www.taradov.com | SAM E70 BB v1.0